# Altium schematic sheet KTIR-FRONT.SchDoc
size A4; SheetNumber: 5; SheetTotal: 6
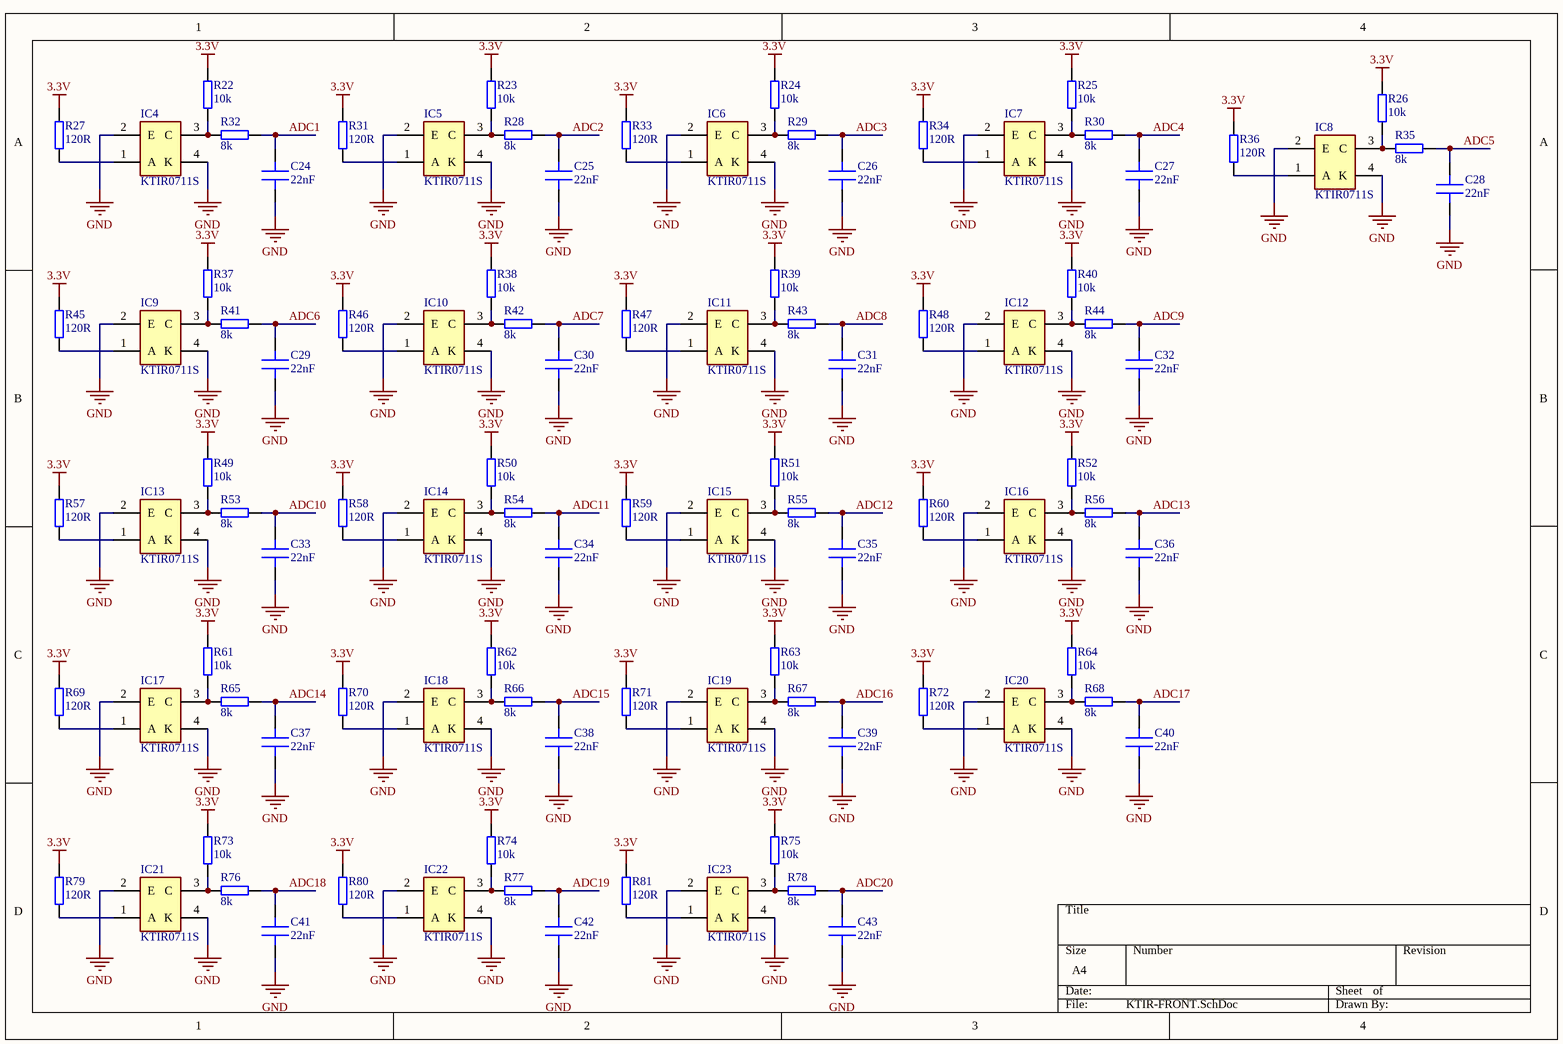
[diagram p0: KTIR-FRONT.SchDoc]

## Parts
C24  22nF  [C 0603]
C25  22nF  [C 0603]
C26  22nF  [C 0603]
C27  22nF  [C 0603]
C28  22nF  [C 0603]
C29  22nF  [C 0603]
C30  22nF  [C 0603]
C31  22nF  [C 0603]
C32  22nF  [C 0603]
C33  22nF  [C 0603]
C34  22nF  [C 0603]
C35  22nF  [C 0603]
C36  22nF  [C 0603]
C37  22nF  [C 0603]
C38  22nF  [C 0603]
C39  22nF  [C 0603]
C40  22nF  [C 0603]
C41  22nF  [C 0603]
C42  22nF  [C 0603]
C43  22nF  [C 0603]
IC4  KTIR0711S  [KTIR0711S]
IC5  KTIR0711S  [KTIR0711S]
IC6  KTIR0711S  [KTIR0711S]
IC7  KTIR0711S  [KTIR0711S]
IC8  KTIR0711S  [KTIR0711S]
IC9  KTIR0711S  [KTIR0711S]
IC10  KTIR0711S  [KTIR0711S]
IC11  KTIR0711S  [KTIR0711S]
IC12  KTIR0711S  [KTIR0711S]
IC13  KTIR0711S  [KTIR0711S]
IC14  KTIR0711S  [KTIR0711S]
IC15  KTIR0711S  [KTIR0711S]
IC16  KTIR0711S  [KTIR0711S]
IC17  KTIR0711S  [KTIR0711S]
IC18  KTIR0711S  [KTIR0711S]
IC19  KTIR0711S  [KTIR0711S]
IC20  KTIR0711S  [KTIR0711S]
IC21  KTIR0711S  [KTIR0711S]
IC22  KTIR0711S  [KTIR0711S]
IC23  KTIR0711S  [KTIR0711S]
R22  10k  [R 0603]
R23  10k  [R 0603]
R24  10k  [R 0603]
R25  10k  [R 0603]
R26  10k  [R 0603]
R27  120R  [R 0603]
R28  8k  [R 0603]
R29  8k  [R 0603]
R30  8k  [R 0603]
R31  120R  [R 0603]
R32  8k  [R 0603]
R33  120R  [R 0603]
R34  120R  [R 0603]
R35  8k  [R 0603]
R36  120R  [R 0603]
R37  10k  [R 0603]
R38  10k  [R 0603]
R39  10k  [R 0603]
R40  10k  [R 0603]
R41  8k  [R 0603]
R42  8k  [R 0603]
R43  8k  [R 0603]
R44  8k  [R 0603]
R45  120R  [R 0603]
R46  120R  [R 0603]
R47  120R  [R 0603]
R48  120R  [R 0603]
R49  10k  [R 0603]
R50  10k  [R 0603]
R51  10k  [R 0603]
R52  10k  [R 0603]
R53  8k  [R 0603]
R54  8k  [R 0603]
R55  8k  [R 0603]
R56  8k  [R 0603]
R57  120R  [R 0603]
R58  120R  [R 0603]
R59  120R  [R 0603]
R60  120R  [R 0603]
R61  10k  [R 0603]
R62  10k  [R 0603]
R63  10k  [R 0603]
R64  10k  [R 0603]
R65  8k  [R 0603]
R66  8k  [R 0603]
R67  8k  [R 0603]
R68  8k  [R 0603]
R69  120R  [R 0603]
R70  120R  [R 0603]
R71  120R  [R 0603]
R72  120R  [R 0603]
R73  10k  [R 0603]
R74  10k  [R 0603]
R75  10k  [R 0603]
R76  8k  [R 0603]
R77  8k  [R 0603]
R78  8k  [R 0603]
R79  120R  [R 0603]
R80  120R  [R 0603]
R81  120R  [R 0603]

## Nets
3.3V: R22.1 R23.1 R24.1 R25.1 R26.1 R27.1 R31.1 R33.1 R34.1 R36.1 R37.1 R38.1 R39.1 R40.1 R45.1 R46.1 R47.1 R48.1 R49.1 R50.1 R51.1 R52.1 R57.1 R58.1 R59.1 R60.1 R61.1 R62.1 R63.1 R64.1 R69.1 R70.1 R71.1 R72.1 R73.1 R74.1 R75.1 R79.1 R80.1 R81.1
GND: C24.2 C25.2 C26.2 C27.2 C28.2 C29.2 C30.2 C31.2 C32.2 C33.2 C34.2 C35.2 C36.2 C37.2 C38.2 C39.2 C40.2 C41.2 C42.2 C43.2 IC4.2(E) IC4.4(K) IC5.2(E) IC5.4(K) IC6.2(E) IC6.4(K) IC7.2(E) IC7.4(K) IC8.2(E) IC8.4(K) IC9.2(E) IC9.4(K) IC10.2(E) IC10.4(K) IC11.2(E) IC11.4(K) IC12.2(E) IC12.4(K) IC13.2(E) IC13.4(K) IC14.2(E) IC14.4(K) IC15.2(E) IC15.4(K) IC16.2(E) IC16.4(K) IC17.2(E) IC17.4(K) IC18.2(E) IC18.4(K) IC19.2(E) IC19.4(K) IC20.2(E) IC20.4(K) IC21.2(E) IC21.4(K) IC22.2(E) IC22.4(K) IC23.2(E) IC23.4(K)
ADC1: C24.1 R32.1
ADC2: C25.1 R28.1
ADC3: C26.1 R29.1
ADC4: C27.1 R30.1
ADC5: C28.1 R35.1
ADC6: C29.1 R41.1
ADC7: C30.1 R42.1
ADC8: C31.1 R43.1
ADC9: C32.1 R44.1
ADC10: C33.1 R53.1
ADC11: C34.1 R54.1
ADC12: C35.1 R55.1
ADC13: C36.1 R56.1
ADC14: C37.1 R65.1
ADC15: C38.1 R66.1
ADC16: C39.1 R67.1
ADC17: C40.1 R68.1
ADC18: C41.1 R76.1
ADC19: C42.1 R77.1
ADC20: C43.1 R78.1
NetIC4_1: IC4.1(A) R27.2
NetIC4_3: IC4.3(C) R22.2 R32.2
NetIC5_1: IC5.1(A) R31.2
NetIC5_3: IC5.3(C) R23.2 R28.2
NetIC6_1: IC6.1(A) R33.2
NetIC6_3: IC6.3(C) R24.2 R29.2
NetIC7_1: IC7.1(A) R34.2
NetIC7_3: IC7.3(C) R25.2 R30.2
NetIC8_1: IC8.1(A) R36.2
NetIC8_3: IC8.3(C) R26.2 R35.2
NetIC9_1: IC9.1(A) R45.2
NetIC9_3: IC9.3(C) R37.2 R41.2
NetIC10_1: IC10.1(A) R46.2
NetIC10_3: IC10.3(C) R38.2 R42.2
NetIC11_1: IC11.1(A) R47.2
NetIC11_3: IC11.3(C) R39.2 R43.2
NetIC12_1: IC12.1(A) R48.2
NetIC12_3: IC12.3(C) R40.2 R44.2
NetIC13_1: IC13.1(A) R57.2
NetIC13_3: IC13.3(C) R49.2 R53.2
NetIC14_1: IC14.1(A) R58.2
NetIC14_3: IC14.3(C) R50.2 R54.2
NetIC15_1: IC15.1(A) R59.2
NetIC15_3: IC15.3(C) R51.2 R55.2
NetIC16_1: IC16.1(A) R60.2
NetIC16_3: IC16.3(C) R52.2 R56.2
NetIC17_1: IC17.1(A) R69.2
NetIC17_3: IC17.3(C) R61.2 R65.2
NetIC18_1: IC18.1(A) R70.2
NetIC18_3: IC18.3(C) R62.2 R66.2
NetIC19_1: IC19.1(A) R71.2
NetIC19_3: IC19.3(C) R63.2 R67.2
NetIC20_1: IC20.1(A) R72.2
NetIC20_3: IC20.3(C) R64.2 R68.2
NetIC21_1: IC21.1(A) R79.2
NetIC21_3: IC21.3(C) R73.2 R76.2
NetIC22_1: IC22.1(A) R80.2
NetIC22_3: IC22.3(C) R74.2 R77.2
NetIC23_1: IC23.1(A) R81.2
NetIC23_3: IC23.3(C) R75.2 R78.2

## Library data of the parts
C24-C43 = Capacitor: MLCC Capacitor
IC4-IC23 = KTIR0711S: Integrated Circuit; Manufacturer_Name: Kingbright; Datasheet Link: https://componentsearchengine.com/Datasheets/2/KTIR0711S.pdf; Height: 1.75mm; Manufacturer_Part_Number: KTIR0711S; Mouser Part Number: N/A; Mouser Price/Stock: https://www.mouser.co.uk/ProductDetail/Kingbright/KTIR0711S?qs=2JU0tDl2GZ3YXiPz2j0FpQ%3D%3D
R22-R81 = Resistor: General pourpouse resistor